# EAGLE design mini_controller_m328_2 (EAGLE 9.6.2)
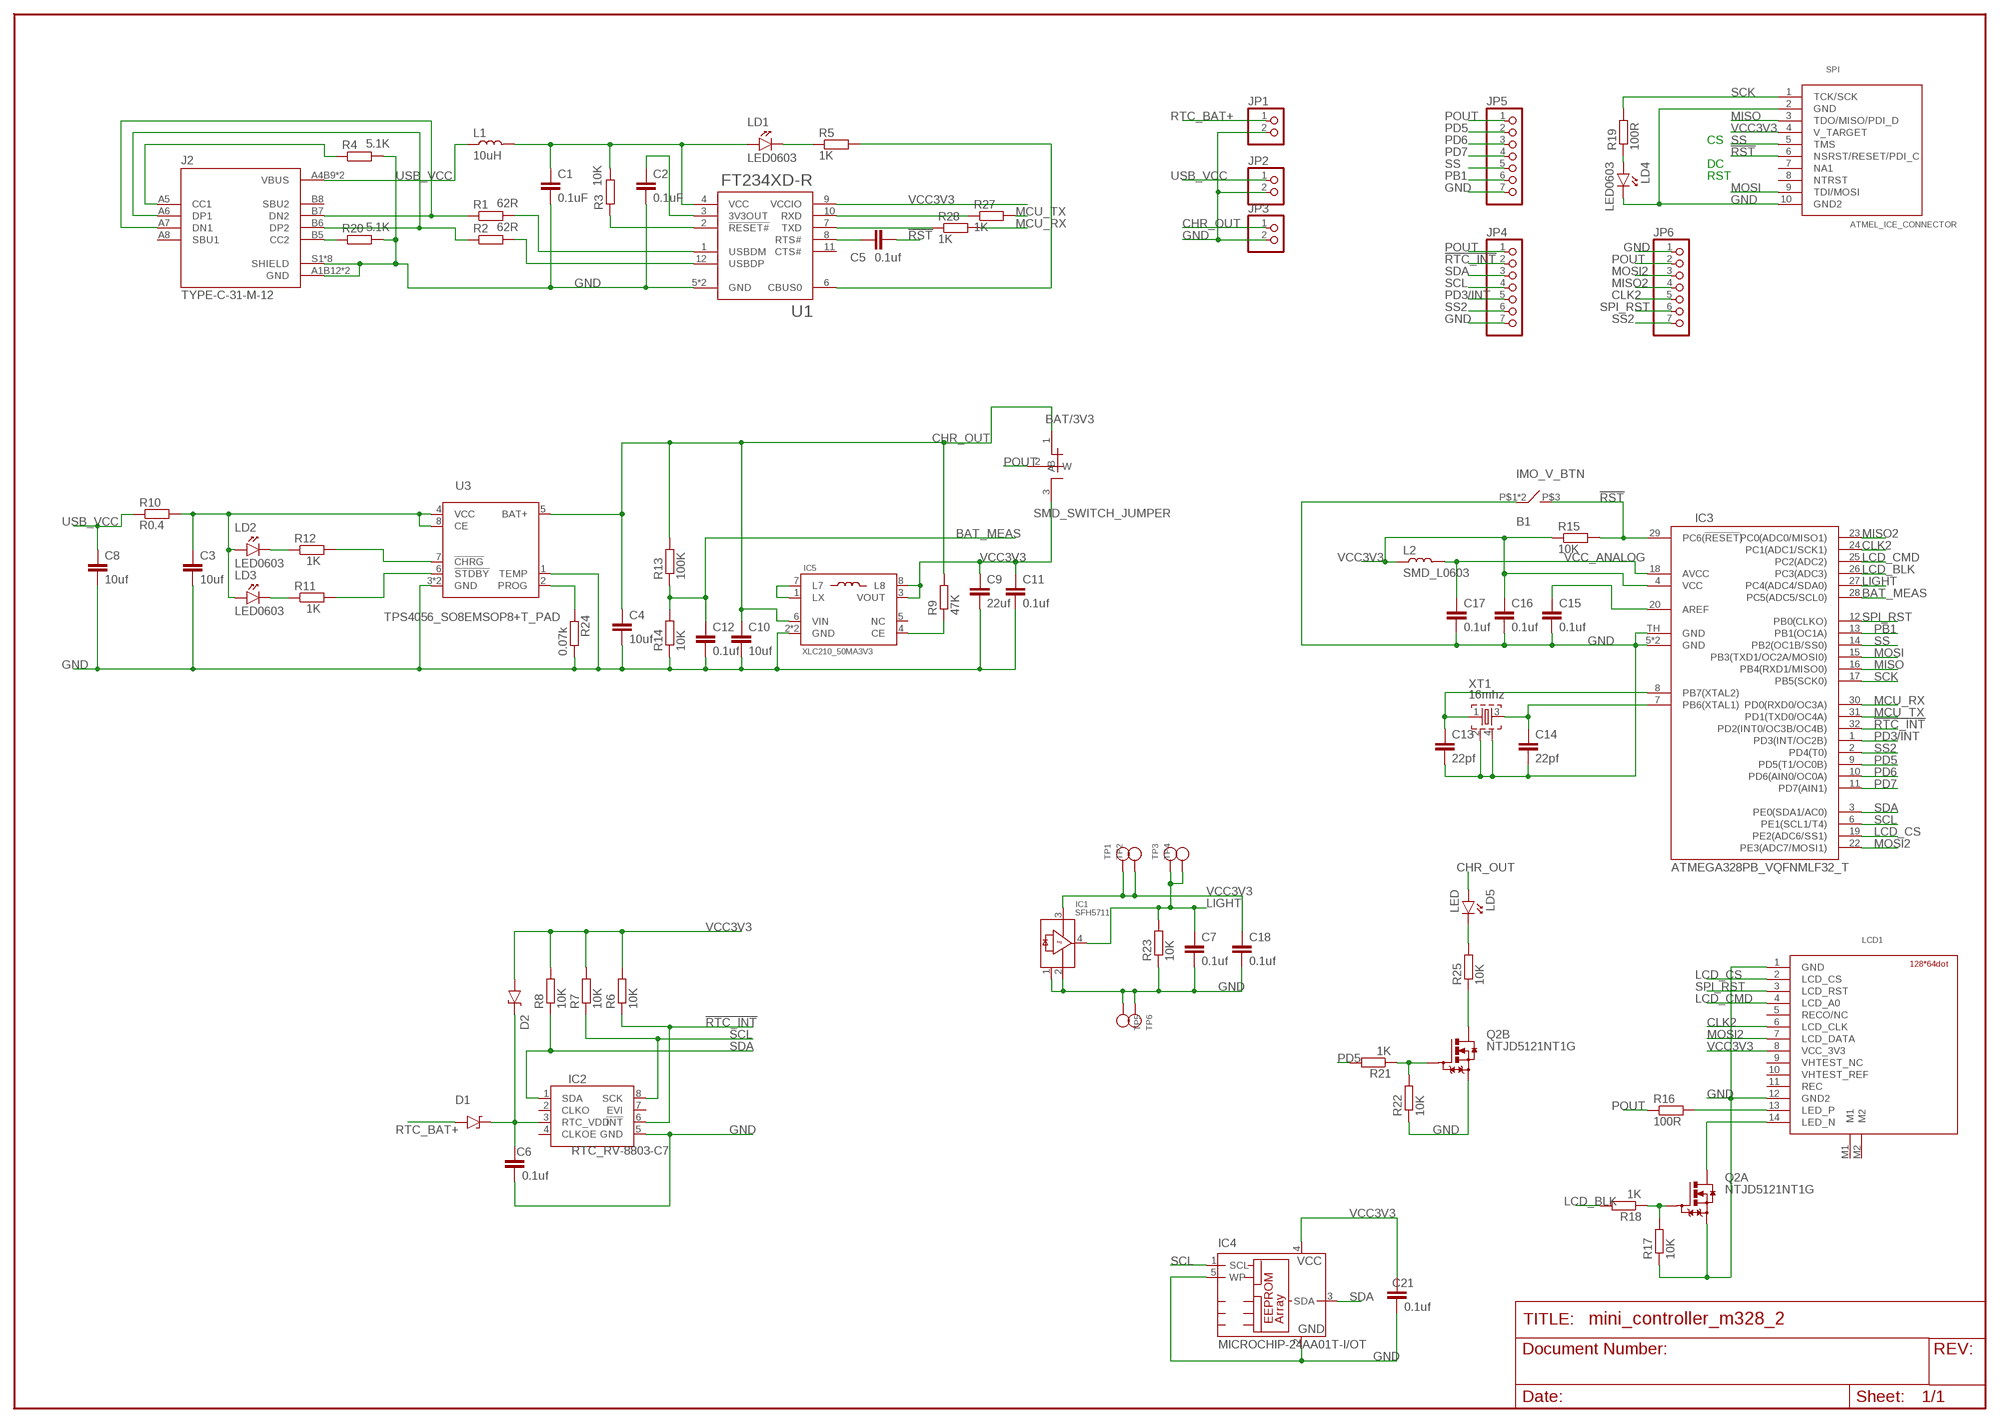
[diagram p0: schematic, sheet 1]

## Parts
B1  IMO_V_BTN  [IMO_V_BNN]
BAT/3V3  SMD_SWITCH_JUMPER  [0603_JUMP]
C1  0.1uF  SMD_C0603  [0603]
C2  0.1uF  SMD_C0603  [0603]
C3  10uf  SMD_C1206  [1206]
C4  10uf  SMD_C1206  [1206]
C5  0.1uf  SMD_C0603  [0603]
C6  0.1uf  SMD_C0603  [0603]
C7  0.1uf  SMD_C0603  [0603]
C8  10uf  SMD_C1206  [1206]
C9  22uf  SMD_C0805  [0805]
C10  10uf  SMD_C0603  [0603]
C11  0.1uf  SMD_C0603  [0603]
C12  0.1uf  SMD_C0603  [0603]
C13  22pf  SMD_C0603  [0603]
C14  22pf  SMD_C0603  [0603]
C15  0.1uf  SMD_C0603  [0603]
C16  0.1uf  SMD_C0603  [0603]
C17  0.1uf  SMD_C0603  [0603]
C18  0.1uf  SMD_C0603  [0603]
C21  0.1uf  SMD_C0603  [0603]
D1  D_SOD323  [SOD-323_D]
D2  D_SOD323  [SOD-323_D]
IC1  SFH5711  [SFH5711]
IC2  RTC_RV-8803-C7  [C7_RTC]
IC3  ATMEGA328PB_VQFNMLF32_T  [MLF32-TH]
IC4  MICROCHIP-24AA01T-I/OT  [SOT-23(5)]
IC5  XLC210_50MA3V3  [XCL210_50MA3V3]
J2  TYPE-C-31-M-12  [HRO_TYPE-C-31-M-12]
JP1  PINHD-1X2  [1X02]
JP2  PINHD-1X2  [1X02]
JP3  PINHD-1X2  [1X02]
JP4  PINHD-1X7  [1X07]
JP5  PINHD-1X7  [1X07]
JP6  PINHD-1X7  [1X07]
L1  10uH  SMD_L0603  [0603]
L2  SMD_L0603  [0603]
LCD1  ALE_LCD_128X64  [ALE_LCD_14PIN_CONNECTOR]
LD1  LED0603  [0603_P]
LD2  LED0603  [0603_P]
LD3  LED0603  [0603_P]
LD4  LED0603  [0603_P]
LD5  LED  [3MM_DIP_LED]
Q2  NTJD5121NT1G  [SOT363]
R1  62R  SMD_R0603  [0603]
R2  62R  SMD_R0603  [0603]
R3  10K  SMD_R0603  [0603]
R4  5.1K  SMD_R0603  [0603]
R5  1K  SMD_R0603  [0603]
R6  10K  SMD_R0603  [0603]
R7  10K  SMD_R0603  [0603]
R8  10K  SMD_R0603  [0603]
R9  47K  SMD_R0603  [0603]
R10  R0.4  SMD_R1206  [1206]
R11  1K  SMD_R0603  [0603]
R12  1K  SMD_R0603  [0603]
R13  100K  SMD_R0603  [0603]
R14  10K  SMD_R0603  [0603]
R15  10K  SMD_R0603  [0603]
R16  100R  SMD_R0603  [0603]
R17  10K  SMD_R0603  [0603]
R18  1K  SMD_R0603  [0603]
R19  100R  SMD_R0603  [0603]
R20  5.1K  SMD_R0603  [0603]
R21  1K  SMD_R0603  [0603]
R22  10K  SMD_R0603  [0603]
R23  10K  SMD_R0603  [0603]
R24  0.07k  SMD_R0603  [0603]
R25  10K  SMD_R0603  [0603]
R27  1K  SMD_R0603  [0603]
R28  1K  SMD_R0603  [0603]
SPI  ATMEL_ICE_CONNECTOR  [MINI10P_SPI/JTAG/PDI]
TP1  TEST_POINT_D2MM  [TP]
TP2  TEST_POINT_D2MM  [TP]
TP3  TEST_POINT_D2MM  [TP]
TP4  TEST_POINT_D2MM  [TP]
TP5  TEST_POINT_D2MM  [TP]
TP6  TEST_POINT_D2MM  [TP]
U1  FT234XD-R  [IC_FT234XD-R]
U3  TPS4056_SO8EMSOP8+T_PAD  [EMSOP8+TPAD]
XT1  16mhz  QUARTZ_ZQ  [QUARTZ_3X3MM]

## Nets
!RST: B1.P$3 C5.2 IC3.29(PC6(!RESET!)) R15.2 SPI.6(NSRST/RESET/PDI_C)
!RTC_INT: IC2.6(!INT) IC3.32(PD2(INT0/OC3B/OC4B)) JP4.2 R6.1
BAT_MEAS: C12.1 IC3.28(PC5(ADC5/SCL0)) R13.1 R14.2
CHR_OUT: BAT/3V3.1(A) C4.1 C10.1 IC5.6(VIN) JP3.1 LD5.A R9.2 R13.2 U3.5(BAT+)
CLK2: IC3.24(PC1(ADC1/SCK1)) JP6.5 LCD1.6(LCD_CLK)
DM2: R1.2 U1.1(USBDM)
DP2: R2.2 U1.12(USBDP)
GND: B1.P$1 B1.P$2 C1.2 C2.2 C3.2 C4.2 C6.2 C7.2 C8.2 C9.2 C10.2 C11.2 C12.2 C13.2 C14.2 C15.2 C16.2 C17.2 C18.2 C21.2 IC1.1 IC1.2 IC2.5(GND) IC3.5(GND) IC3.21(GND) IC3.TH(GND) IC4.2(GND) IC4.5(WP) IC5.2(GND) IC5.9(GND) J2.A1B12(GND) J2.B1A12(GND) J2.S1(SHIELD) J2.S2(SHIELD) J2.S3(SHIELD) J2.S4(SHIELD) J2.S5(SHIELD) J2.S6(SHIELD) J2.S7(SHIELD) J2.S8(SHIELD) JP1.2 JP2.2 JP3.2 JP4.7 JP5.7 JP6.1 LCD1.1(GND) LCD1.12(GND2) LD4.1(K) Q2.1(A:S) Q2.4(B:S) R4.2 R14.1 R17.1 R20.2 R22.1 R23.1 R24.2 SPI.2(GND) SPI.10(GND2) TP5.P$1 TP6.P$1 U1.5(GND) U1.13(GND) U3.1(TEMP) U3.3(GND) U3.TPAD(GND) XT1.2 XT1.4
LCD_BLK: IC3.26(PC3(ADC3)) R18.2
LCD_CMD: IC3.25(PC2(ADC2)) LCD1.4(LCD_A0)
LCD_CS: IC3.19(PE2(ADC6/SS1)) LCD1.2(LCD_CS)
LIGHT: C7.1 IC1.4 IC3.27(PC4(ADC4/SDA0)) R23.2 TP3.P$1 TP4.P$1
MCU_RX: IC3.30(PD0(RXD0/OC3A)) R28.2
MCU_TX: IC3.31(PD1(TXD0/OC4A)) R27.2
MISO: IC3.16(PB4(RXD1/MISO0)) SPI.3(TDO/MISO/PDI_D)
MISO2: IC3.23(PC0(ADC0/MISO1)) JP6.4
MOSI: IC3.15(PB3(TXD1/OC2A/MOSI0)) SPI.9(TDI/MOSI)
MOSI2: IC3.22(PE3(ADC7/MOSI1)) JP6.3 LCD1.7(LCD_DATA)
N$1: LCD1.13(LED_P) R16.2
N$2: LCD1.14(LED_N) Q2.6(A:D)
N$3: IC5.1(LX) IC5.7(L7)
N$4: Q2.2(A:G) R17.2 R18.1
N$5: IC5.4(CE) R9.1
N$6: C3.1 LD2.2(A) LD3.2(A) R10.2 U3.4(VCC) U3.8(CE)
N$7: C1.1 L1.2 LD1.2(A) R3.2 U1.4(VCC)
N$8: C13.1 IC3.8(PB7(XTAL2)) XT1.1
N$9: C2.1 U1.3(3V3OUT)
N$10: LD1.1(K) R5.1
N$11: R5.2 U1.6(CBUS0)
N$12: C14.1 IC3.7(PB6(XTAL1)) XT1.3
N$13: R24.1 U3.2(PROG)
N$14: R27.1 U1.10(RXD)
N$15: C5.1 U1.8(RTS#)
N$16: LD4.2(A) R19.1
N$17: J2.A5(CC1) R4.1
N$18: R12.2 U3.7(!CHRG)
N$19: C6.1 D1.K D2.K IC2.3(RTC_VDD)
N$20: C15.1 IC3.20(AREF)
N$21: J2.A7(DN1) J2.B7(DN2) R1.1
N$22: J2.A6(DP1) J2.B6(DP2) R2.1
N$23: LD2.1(K) R12.1
N$24: LD3.1(K) R11.1
N$25: R11.2 U3.6(!STDBY)
N$26: Q2.5(B:G) R21.1 R22.2
N$27: R28.1 U1.7(TXD)
N$28: J2.B5(CC2) R20.1
N$29: LD5.K R25.2
N$30: Q2.3(B:D) R25.1
PB1: IC3.13(PB1(OC1A)) JP5.6
PD3/INT: IC3.1(PD3(INT/OC2B)) JP4.5
PD5: IC3.9(PD5(T1/OC0B)) JP5.2 R21.2
PD6: IC3.10(PD6(AIN0/OC0A)) JP5.3
PD7: IC3.11(PD7(AIN1)) JP5.4
POUT: BAT/3V3.2(W) JP4.1 JP5.1 JP6.2 R16.1
RTC_BAT+: D1.A JP1.1
SCK: IC3.17(PB5(SCK0)) R19.2 SPI.1(TCK/SCK)
SCL: IC2.8(SCK) IC3.6(PE1(SCL1/T4)) IC4.1(SCL) JP4.4 R7.1
SDA: IC2.1(SDA) IC3.3(PE0(SDA1/AC0)) IC4.3(SDA) JP4.3 R8.1
SER_RST: R3.1 U1.2(!RESET#)
SPI_RST: IC3.12(PB0(CLKO)) JP6.6 LCD1.3(LCD_RST)
SS: IC3.14(PB2(OC1B/SS0)) JP5.5 SPI.5(TMS)
SS2: IC3.2(PD4(T0)) JP4.6 JP6.7
USB_VCC: C8.1 J2.A4B9(VBUS) J2.B4A9(VBUS) JP2.1 L1.1 R10.1
VCC3V3: BAT/3V3.3(B) C9.1 C11.1 C16.1 C18.1 C21.1 D2.A IC1.3 IC3.4(VCC) IC4.4(VCC) IC5.3(VOUT) IC5.8(L8) L2.1 LCD1.8(VCC_3V3) R6.2 R7.2 R8.2 R15.1 SPI.4(V_TARGET) TP1.P$1 TP2.P$1 U1.9(VCCIO)
VCC_ANALOG: C17.1 IC3.18(AVCC) L2.2
Unconnected: IC2.2(CLKO) IC2.4(CLKOE) IC2.7(EVI) IC5.5(NC) J2.A8(SBU1) J2.B8(SBU2) LCD1.5(RECO/NC) LCD1.9(VHTEST_NC) LCD1.10(VHTEST_REF) LCD1.11(REC) LCD1.M1 LCD1.M2 SPI.7(NA1) SPI.8(NTRST) U1.11(CTS#)

## Notes on the sheet
- CS
- DC
- RST

## Library data of the parts
B1 = passive_components:IMO_V_BTN
BAT/3V3 = passive_components:SMD_SWITCH_JUMPER
C1-C18 C21 = passive_components:SMD_C
D1 D2 = rcl:D_SOD323
IC1 = SFH5711:SFH5711; AVAILABILITY: Unavailable; DESCRIPTION: Optical Sensor Ambient 555nm Current 4-SMD, No Lead; MF: OSRAM Opto; MP: SFH5711; PACKAGE: SMD-4 OSRAM Opto; PRICE: None
IC2 = my_IC:RTC_RV-8803-C7
IC3 = my_IC:ATMEGA328PB_VQFN
IC4 = my_IC:MICROCHIP-24AA01T-I/OT
IC5 = my_IC:XLC210_50MA3V3
J2 = TYPE-C-31-M-12:TYPE-C-31-M-12: USB Connectors 24 Receptacle 1 8.94*7.3mm RoHS Check availability <https://pricing.snapeda.com/parts/TYPE-C-31-M-12/HRO%20Electronics%20Co.%2C%20Ltd./view-part?ref=eda>; AVAILABILITY: In Stock; DESCRIPTION: USB Connectors 24 Receptacle 1 8.94*7.3mm RoHS; MF: HRO Electronics Co., Ltd.; MP: TYPE-C-31-M-12; PACKAGE: Package; PRICE: None
JP1-JP3 = pinhead:PINHD-1X2: PIN HEADER
JP4-JP6 = pinhead:PINHD-1X7: PIN HEADER
L1 L2 = passive_components:SMD_L
LCD1 = passive_components:ALE_LCD_128X64
LD1-LD5 = passive_components:LED
Q2 = on-semiconductor-ntjd5121nt1g:NTJD5121NT1G: NTJD5121N, Dual N−Channel with ESD Power MOSFET 60 V, 295 mA, Dual N−Channel with ESD Protection, SC−88 Source: Datasheet <http://www.farnell.com/datasheets/1708304.pdf>; MF: ON SEMICONDUCTOR; MPN: NTJD5121NT1G; OC_FARNELL: 2317611; OC_NEWARK: unknown
R1-R25 R27 R28 = passive_components:SMD_R
SPI = passive_components:ATMEL_ICE_CONNECTOR
TP1-TP6 = passive_components:TEST_POINT_D2MM
U1 = my_IC:FT234XD-R: USB Bridge, USB to UART USB 2.0 UART Interface 12-DFN (3x3); AVAILABILITY: Unavailable; DESCRIPTION: USB Bridge, USB to UART USB 2.0 UART Interface 12-DFN (3x3); MF: FTDI,; MP: FT234XD-R; PACKAGE: DFN-12 FTDI; PRICE: None
U3 = my_IC:TPS4056_SO8
XT1 = passive_components:QUARTZ_ZQ

## Board
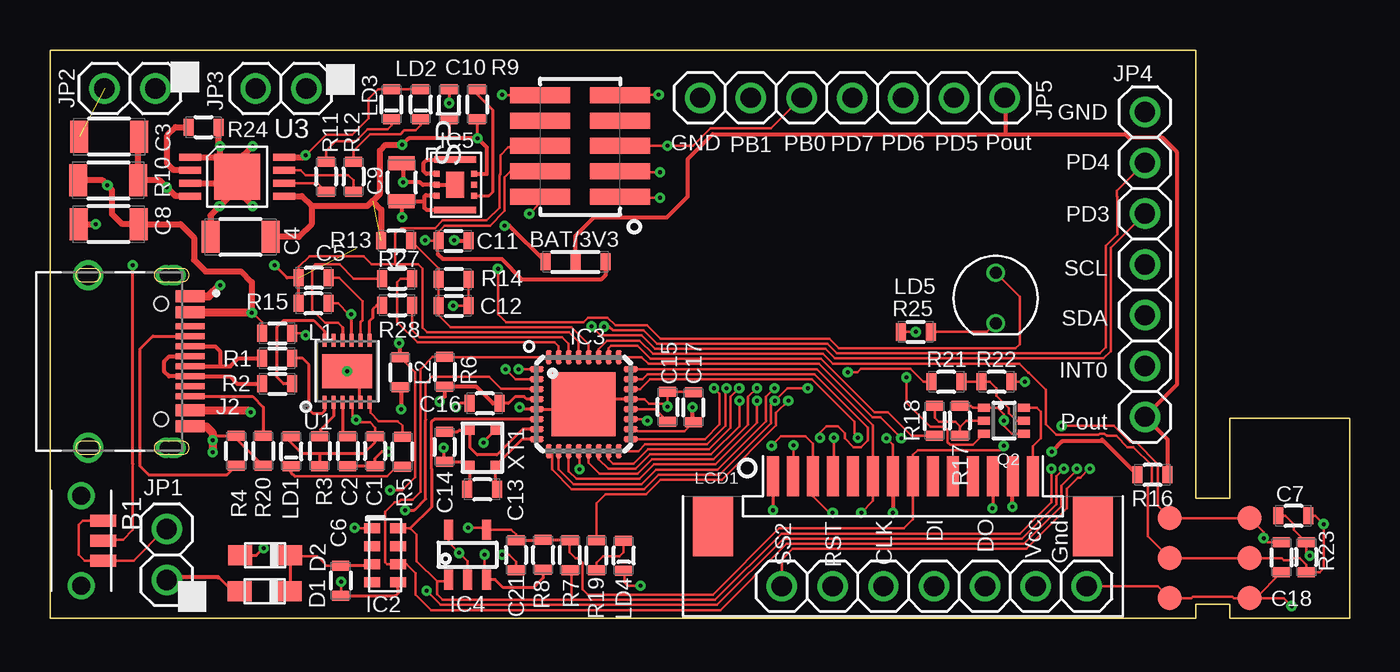
[diagram p1: board, top side]
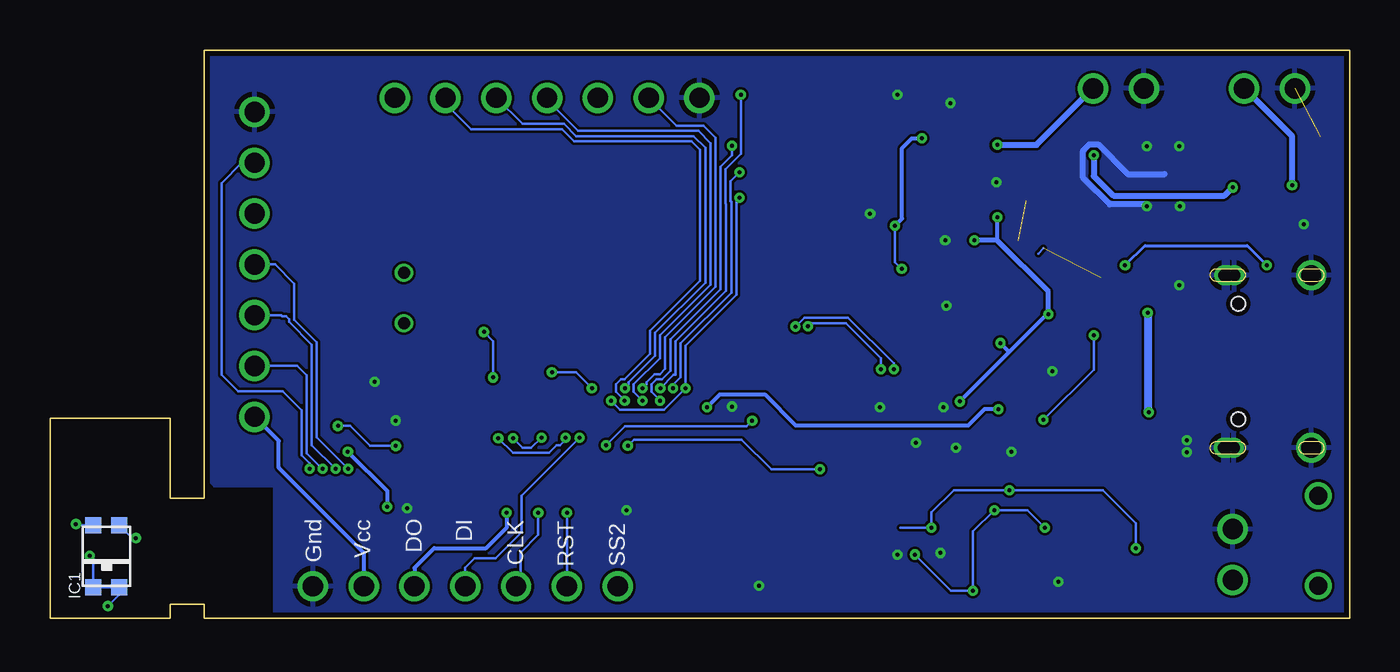
[diagram p2: board, bottom side, seen from below]

Size 65 x 28.4 mm. Coordinates in mm from the lower left corner, seen from the top.
Outline: 65,0 65,10 59,10 59,6 57.3,6 57.3,28.4 0,28.4 0,0 57.3,0 57.3,0.7 59,0.7 59,0 65,0
Copper layers (1*16): Top 0.035mm / dielectric 1.5mm / Bottom 0.035mm
Design rules "default *": minimum track width 5mil, minimum drill 0.2mm, track to track 5mil, track to pad 5mil, pad to pad 5mil, via to via 5mil, smd to smd 5mil, copper to edge 10mil, drill to drill 0.4mm, minimum pad ring 6mil, minimum via ring 6mil, stop-mask expansion 4mil, vias tented up to drill 20mil, thermal gap 10mil

### Footprints (pad centres in the part's own frame; a part is rotated, then mirrored left to right if it is on the bottom)
IMO_V_BNN = drill 0.9: M1 -2.25,0; M2 2.25,0 | smd 0.6 x 1.3: P$1 -1,-1.1; P$2 1,-1.1; P$3 0,-1.1
0603_JUMP = smd 0.85 x 0.5: 1 0,0.75; 2 0,-0.75; 3 0,-2.25
0603 = smd 0.85 x 0.5: 1 0,0.75; 2 0,-0.75
1206 = smd 1.6 x 0.9: 1 0,1.5; 2 0,-1.5
0805 = smd 1.3 x 0.7: 1 0,0.95; 2 0,-0.95
SOD-323_D = smd 1.2 x 1: A 1.25,0; K -1.25,0
SFH5711 = smd 0.8 x 0.8: 1 -0.65,-1.55; 2 0.65,-1.55; 3 0.65,1.55; 4 -0.65,1.55
C7_RTC = smd 0.8 x 0.5: 1 -0.65,1.35; 2 -0.65,0.45; 3 -0.65,-0.45; 4 -0.65,-1.35; 5 0.65,-1.35; 6 0.65,-0.45; 7 0.65,0.45; 8 0.65,1.35
MLF32-TH = smd 0.7 x 0.3: 1 -2.35,1.75; 2 -2.35,1.25; 3 -2.35,0.75; 4 -2.35,0.25; 5 -2.35,-0.25; 6 -2.35,-0.75; 7 -2.35,-1.25; 8 -2.35,-1.75; 17 2.35,-1.75; 18 2.35,-1.25; 19 2.35,-0.75; 20 2.35,-0.25; 21 2.35,0.25; 22 2.35,0.75; 23 2.35,1.25; 24 2.35,1.75 | smd 0.3 x 0.7: 9 -1.75,-2.35; 10 -1.25,-2.35; 11 -0.75,-2.35; 12 -0.25,-2.35; 13 0.25,-2.35; 14 0.75,-2.35; 15 1.25,-2.35; 16 1.75,-2.35; 25 1.75,2.35; 26 1.25,2.35; 27 0.75,2.35; 28 0.25,2.35; 29 -0.25,2.35; 30 -0.75,2.35; 31 -1.25,2.35; 32 -1.75,2.35 | smd 3.2 x 3.2: TH 0,0
SOT-23(5) = smd 0.45 x 1: 1 -0.95,-1.25; 2 0,-1.25; 3 0.95,-1.25; 4 0.95,1.25; 5 -0.95,1.25
XCL210_50MA3V3 = smd 0.3 x 0.3: 1 -0.92,0.55; 2 -0.92,0; 3 -0.92,-0.55; 4 0.95,-0.55; 5 0.95,0; 6 0.95,0.55 | smd 2.1 x 0.325: 7 0,1.262; 8 0,-1.262 | smd 0.9 x 1.3: 9 0,0
HRO_TYPE-C-31-M-12 = smd 0.6 x 1.45: A1B12 -3.25,5.095; A4B9 -2.45,5.095; B1A12 3.25,5.095; B4A9 2.45,5.095 | smd 0.3 x 1.45: A5 -1.25,5.095; A6 -0.25,5.095; A7 0.25,5.095; A8 1.25,5.095; B5 1.75,5.095; B6 0.75,5.095; B7 -0.75,5.095; B8 -1.75,5.095 | drill 0.6 pad 1: S1 -4.32,4.18; S2 4.32,4.18; S5 -4.31,3.87; S6 -4.31,4.37; S7 4.32,3.88; S8 4.32,4.38 | drill 1 pad 1.4: S3 -4.32,0; S4 4.32,0 | hole 0.7: -2.89,3.65; 2.89,3.65
1X02 = drill 1.016: 1 -1.27,0; 2 1.27,0
1X07 = drill 1.016: 1 -7.62,0; 2 -5.08,0; 3 -2.54,0; 4 0,0; 5 2.54,0; 6 5.08,0; 7 7.62,0
ALE_LCD_14PIN_CONNECTOR = smd 0.6 x 2: 1 6.5,-1; 2 5.5,-1; 3 4.5,-1; 4 3.5,-1; 5 2.5,-1; 6 1.5,-1; 7 0.5,-1; 8 -0.5,-1; 9 -1.5,-1; 10 -2.5,-1; 11 -3.5,-1; 12 -4.5,-1; 13 -5.5,-1; 14 -6.5,-1 | smd 2 x 3: M1 9.5,1.5; M2 -9.5,1.5
0603_P = smd 0.85 x 0.5: 1 0,0.75; 2 0,-0.75
3MM_DIP_LED = drill 0.6: A 1.27,0; K -1.27,0
SOT363 = smd 0.4 x 0.6: 1 -0.65,-1; 2 0,-1; 3 0.65,-1; 4 0.65,1; 5 0,1; 6 -0.65,1
MINI10P_SPI/JTAG/PDI = smd 0.8 x 3: 1 0,-4; 2 0,0; 3 1.27,-4; 4 1.27,0; 5 2.54,-4; 6 2.54,0; 7 3.81,-4; 8 3.81,0; 9 5.08,-4; 10 5.08,0
TP = smd 1.2 x 1.2: P$1 0,0
IC_FT234XD-R = smd 0.65 x 0.25: 1 -1.55,1.125; 2 -1.55,0.675; 3 -1.55,0.225; 4 -1.55,-0.225; 5 -1.55,-0.675; 6 -1.55,-1.125; 7 1.55,-1.125; 8 1.55,-0.675; 9 1.55,-0.225; 10 1.55,0.225; 11 1.55,0.675; 12 1.55,1.125 | smd 1.7 x 2.5: 13 0,0
EMSOP8+TPAD = smd 0.35 x 1.1: 1 -0.975,-2.35; 2 -0.325,-2.35; 3 0.325,-2.35; 4 0.975,-2.35; 5 0.975,2.35; 6 0.325,2.35; 7 -0.325,2.35; 8 -0.975,2.35 | smd 2.3 x 2.3: TPAD 0,0
QUARTZ_3X3MM = smd 0.5 x 0.5: 1 -0.65,0.9; 2 0.65,0.9; 3 0.65,-0.9; 4 -0.65,-0.9

### Placement (x,y rotation side)
B1  1.56,3.87 90 top
BAT/3V3  25.53,17.81 90 top
C1  16.26,8.34 0 top
C2  14.89,8.34 0 top
C3  2.95,24.07 270 top
C4  9.53,19.05 270 top
C5  13.2,17 270 top
C6  14.54,1.87 0 top
C7  62.19,5.1 270 top
C8  2.93,19.69 270 top
C9  17.59,21.78 180 top
C10  19.97,25.69 180 top
C11  20.18,18.86 90 top
C12  20.19,15.61 90 top
C13  21.62,6.43 270 top
C14  19.73,8.56 0 top
C15  30.89,10.55 180 top
C16  21.75,10.73 270 top
C17  32.18,10.53 180 top
C18  61.59,3.03 0 top
C21  23.31,3.15 0 top
D1  10.73,1.33 180 top
D2  10.77,3.14 180 top
IC1  62.18,3.09 0 bottom
IC2  16.77,3.14 0 top
IC3  26.69,10.7 0 top
IC4  20.88,3.17 0 top
IC5  20.26,21.65 0 top
J2  1.91,12.83 270 top
JP1  5.84,3.17 90 top
JP2  4,26.48 180 top
JP3  11.56,26.48 180 top
JP4  54.76,17.68 90 top
JP5  40.14,26.01 180 top
JP6  44.23,1.59 180 top
L1  11.37,14.23 90 top
L2  17.52,12.28 0 top
LCD1  42.67,6.09 180 top
LD1  12.06,8.33 180 top
LD2  18.54,25.69 180 top
LD3  17.08,25.69 180 top
LD4  28.69,3.12 180 top
LD5  47.3,16 90 top
Q2  47.72,9.87 270 top
R1  11.37,12.98 90 top
R2  11.37,11.71 90 top
R3  13.5,8.34 0 top
R4  9.3,8.35 180 top
R5  17.63,8.32 180 top
R6  19.75,12.3 0 top
R7  26,3.14 180 top
R8  24.67,3.16 180 top
R9  21.37,25.69 0 top
R10  2.92,21.88 90 top
R11  13.81,22.07 0 top
R12  15.18,22.07 0 top
R13  17.31,18.86 270 top
R14  20.19,16.95 270 top
R15  13.18,15.73 270 top
R16  55.14,7.15 270 top
R17  45.5,9.87 0 top
R18  44.24,9.86 0 top
R19  27.34,3.13 180 top
R20  10.67,8.35 0 top
R21  44.83,11.81 270 top
R22  47.34,11.81 270 top
R23  62.83,3.04 0 top
R24  7.68,24.54 90 top
R25  43.3,14.3 90 top
R27  17.37,16.97 90 top
R28  17.37,15.65 90 top
SPI  24.52,21.06 90 top
TP1  56,5 0 top
TP2  60,5 0 top
TP3  60,3 0 top
TP4  56,3 0 top
TP5  56,1 0 top
TP6  60,1 0 top
U1  14.86,12.34 90 top
U3  9.37,22.07 270 top
XT1  21.63,8.52 180 top

### Tracks (layer width: path | path; a pad name or v marks a point on that pad's centre or on a via)
!RST  (via drill 0.2)  (1 unrouted)
  Top 0.127: 17.27,17.68 18.41,17.68 18.64,17.46 18.64,14.51 18.86,14.29 25.97,14.29 26.44,13.81 IC3.29 | 17.27,17.68 16.1,17.68 15.68,18.1 12.99,18.1 12.45,17.56 C5.2 | SPI.6 24.44,23.53 22.92,23.53 22.54,23.15 22.54,22.2 22.48,22.14 22.48,20.51 21.84,19.88 19.64,19.88 19.26,19.49 17.56,19.49 17.27,19.21 17.27,17.68 | B1.P$3 2.69,3.9 3.65,3.9 4.15,4.4 4.15,7.69
  Top 0.152: 4.15,7.69 4.15,17.62 v4.13,17.63 | v11.23,17.63 11.85,17 C5.2 12.43,16.99 R15.2
  Bottom 0.127: 15.3,18.48 15.56,18.22
  Bottom 0.152: v4.13,17.63 5.12,18.62 10.24,18.62 v11.23,17.63
!RTC_INT  (via drill 0.2)
  Top 0.127: IC3.32 R6.1 19.15,13.05 18.53,12.43 18.53,6.3 18.13,5.91 17.55,5.91 17.42,5.78 17.24,5.78 16.76,5.3 16.76,2.79 16.87,2.69 IC2.6 17.84,2.69 18.29,2.23 18.29,1.17 19.06,0.4 33.53,0.4 36.85,3.71 48.72,3.71 50.6,5.59 50.6,6.62 51.35,7.38 v51.35,7.47
  Bottom 0.127: JP4.2 52.63,12.6 52.16,12.13 52.16,8.24 51.38,7.47 v51.35,7.47
BAT_MEAS
  Top 0.127: R13.1 19.45,17.48 R14.2 C12.1 19.45,15.13 20.03,14.54 26.08,14.54 26.94,13.68 IC3.28
CHR_OUT  (via drill 0.2)  (1 unrouted)
  Top 0.127: v22.4,17.46 22.4,15.2 22.8,14.8 26.68,14.8 26.91,15.02 27.9,15.02 28.28,14.64 29.86,14.64 30.53,13.97 38.99,13.97 39.47,13.49 48.29,13.49 48.5,13.7 48.5,16.07 LD5.A
  Top 0.152: C10.1 19.97,23.98 | R9.2 21.37,24.05 21.3,23.98
  Top 0.2: IC5.6 21.84,22.2 21.84,23.54 v21.4,23.98 21.3,23.98 19.97,23.98 17.95,23.98 v17.62,23.65
  Top 0.203: BAT/3V3.1 22.97,19.62 v22.73,19.62
  Top 0.305: R13.2 16.56,20.42 16.13,20.85 15.88,20.61 13.08,20.61 | 16.16,20.85 16.51,21.2 16.51,23.37 16.8,23.65 v17.62,23.65 | U3.5 12.6,21.09 13.08,20.61 | 13.08,20.61 13.08,19.68 12.45,19.05 C4.1
  Bottom 0.127: v22.73,19.62 22.73,17.79 v22.4,17.46
  Bottom 0.203: v22.73,19.62 22.38,19.97 22.38,23.5 21.9,23.98 v21.4,23.98
  Bottom 0.305: v17.62,23.65 15.65,23.65 JP3.1
CLK2  (via drill 0.2)
  Top 0.127: IC3.24 38.35,12.45 41.17,9.63 LCD1.6 41.17,5.86 v40.58,5.27
  Bottom 0.127: v40.58,5.27 40.58,4.16 41.47,3.27 41.47,1.81 JP6.5
DM2
  Top 0.152: U1.1 13.74,10.37 13.59,10.22 13.17,10.22 12.96,10.44 12.96,12.66 12.64,12.98 R1.2
DP2
  Top 0.152: R2.2 11.69,11.71 11.37,12.03 11.37,14.56 11.69,14.88 13.18,14.88 13.74,14.32 U1.12
GND  (via drill 0.2)  (1 unrouted)
  Top 0.127: LCD1.12 47.11,7.15 | v14.56,1.81 14.56,1.13 C6.2 | IC4.2 20.88,2.85 v20.47,3.25 19.93,3.79 IC4.5 | C21.2 23.31,2.82 22.96,3.17 v22.61,3.17 | U1.13 v14.87,12.33 | R14.1 C12.2 v20.17,15.61 v20.16,15.62 | IC3.21 29.73,10.95 29.97,10.7 30.77,10.7 v30.89,10.57 C15.2 32.16,11.3 C17.2 | SPI.10 22.62,26.14 v22.61,26.16 | SPI.2 24.52,20.77 v23.98,20.22 | Q2.4 48.12,9.22 47.72,9.62 v47.72,9.87 47.72,10.19 47.39,10.52 Q2.1 46.7,10.51 46.16,10.51 46.05,10.62 R17.1 | R22.1 v48.77,11.81 | B1.P$2 1.64,4.87 1.43,4.67 1.43,3.17 1.73,2.87 B1.P$1 4.17,2.87 5.75,4.45 JP1.2 | LD4.1 28.73,2.33 28.73,1.78 28.89,1.62 v29.53,1.62 | JP6.1 55.41,1.59 TP5.P$1 57.1,1 57.15,1.06 59.15,1.06 59.2,1 TP6.P$1 | C18.2 60.31,1 TP6.P$1 | TP6.P$1 61.7,1 v62.1,0.6 | v63.01,3.11 62.83,3.29 R23.1 62.2,4.42 62.2,4.7 61.8,5.1 C7.2
  Top 0.152: U1.5 15.5,10.83 15.5,11.71 v14.87,12.33 | C2.2 C1.2 16.26,7.98 16.59,8.32 v16.92,8.32 | C6.2 17.29,1.11 17.42,1.25 IC2.5 | LCD1.1 v36.17,5.39 v36.17,5.38 | LCD1.12 47.17,5.51 v47.14,5.49 | C10.2 v19.97,25.75 | v8.13,8.89 8.34,9.1 R4.2 9.3,8.97 R20.2 | C13.2 20.98,6.54 XT1.2 20.79,7.8 C14.2 19.68,7.85 v19.68,8.51 | v21.68,8.76 21.68,8.82 XT1.4 | C16.2 20.51,10.73 v20.32,10.54 | v23.5,10.54 23.59,10.45 IC3.5 25.34,10.45 25.37,10.41 26.41,10.41 IC3.TH 26.94,10.95 IC3.21
  Top 0.2: IC5.9 IC5.2 18.64,21.65 18.51,21.78 v17.65,21.78 17.65,22.67 C9.2
  Top 0.203: C11.2 20.25,18.86 v20.23,18.89 20.23,18.87
  Top 0.305: C8.2 v2.28,19.69 v2.29,19.68 | U3.3 9.04,21.74 U3.TPAD | U3.1 8.39,23.04 U3.TPAD | U3.TPAD 9.37,21.47 v8.48,20.58 8.03,20.13 C4.2 | U3.TPAD 9.37,21.34 v10.13,20.58 | U3.TPAD 8.51,22.92 v8.51,23.59 8.43,23.67 R24.2 | U3.TPAD 9.37,22.83 v10.13,23.59
  Top 0.406: J2.A1B12 7.95,16.08 v8.51,16.64 | J2.B1A12 7.82,9.58 8.13,9.27 v8.13,8.89 v8.13,8.29
  Bottom 0.127: v62.1,0.6 61.53,1.17 IC1.2 IC1.1 62.83,2.93 v63.01,3.11
  Bottom 0.305: v10.13,20.58 10.23,20.68 11.99,20.68 13.33,22.02 13.33,23.37 13.02,23.68 12.57,23.68 11.09,22.19 9.24,22.19
  Bottom 0.356: JP5.7
  pour Bottom: 0.14,28.22 0.14,0.1 53.77,0.1 53.77,28.22
  pour Bottom: 51.55,28.22 57.06,28.22 57.21,28.07 57.21,7 56.8,6.59 51.55,6.59
LCD_BLK
  Top 0.127: IC3.26 27.94,13.5 28.07,13.62 29.38,13.62 30.05,12.96 38.56,12.96 41.23,10.29 41.9,10.29 43.08,9.11 R18.2
LCD_CMD  (via drill 0.2)
  Top 0.127: IC3.25 29.59,13.05 29.94,12.7 38.46,12.7 41.13,10.03 41.53,10.03 v42.58,8.98 | v39.21,9.02 39.21,7.13 LCD1.4
  Bottom 0.127: v42.58,8.98 41.85,8.26 40.05,8.26 39.66,8.64 39.5,8.64 39.21,8.92 v39.21,9.02
LCD_CS  (via drill 0.2)
  Top 0.127: 37.19,7.86 37.19,7.11 LCD1.2 37.18,7.1 v37.18,8.64 | IC3.19 29.8,9.95 v29.88,9.87
  Bottom 0.127: v29.88,9.87 30.16,9.59 36.23,9.59 v37.18,8.64
LIGHT  (via drill 0.2)
  Top 0.127: IC3.27 27.44,13.44 27.88,13.88 29.48,13.88 30.15,13.21 38.67,13.21 39.16,12.72 48.48,12.72 48.95,12.25 49.8,11.4 49.8,10.44 49.82,10.42 49.82,9.68 50.34,9.16 52.45,9.16 52.5,9.21 52.74,9.21 52.86,9.1 53.34,9.1 53.9,8.55 54.2,8.55 55.1,7.64 55.1,6.8 54.9,6.6 54.9,4.1 TP4.P$1 TP3.P$1 61.6,3 61.7,2.9 62,2.9 62.1,3 62.5,3 62.83,2.67 R23.2 | R23.2 | C7.1 63.3,5.1 v63.7,4.7 63.7,2.5 63.5,2.3 R23.2
  Bottom 0.127: v63.7,4.7 63.64,4.64 IC1.4
MCU_RX
  Top 0.127: R28.2 18.12,14.4 18.49,14.03 25.62,14.03 25.94,13.71 IC3.30
MCU_TX
  Top 0.127: R27.2 17.54,16.97 17.37,16.8 17.37,14.8 18.38,13.78 25.24,13.78 25.44,13.58 IC3.31
MISO  (via drill 0.2)
  Top 0.127: IC3.16 29.43,8.35 29.77,8.69 32.86,8.69 33.78,9.61 33.78,11.44 v33.84,11.49 | v30.51,22.29 28.57,22.29 SPI.3
  Bottom 0.127: v33.84,11.49 33.84,11.65 33.47,12.03 33.47,13.73 30.92,16.27 30.92,20.8 30.95,20.84 30.95,21.85 v30.51,22.29
MISO2  (via drill 0.2)
  Top 0.127: IC3.23 29.63,11.95 29.88,12.19 38.25,12.19 40.92,9.52 40.92,8.89 40.57,8.54 40.2,8.54 39.75,8.98 39.75,9.24 39.4,9.59 38.83,9.59 38.51,9.27 v38.51,9.02
  Bottom 0.127: v38.51,9.02 41.41,6.12 41.41,4.28 42.7,2.98 43.75,2.98 44.23,2.51 JP6.4
MOSI  (via drill 0.2)
  Top 0.127: IC3.15 27.94,7.93 28.16,7.71 29.18,7.71 29.9,8.44 32.97,8.44 34.04,9.51 34.04,11.06 v34.47,11.49 | v30.45,26.16 28.54,26.16 SPI.9
  Bottom 0.127: v34.47,11.49 33.81,12.16 33.72,12.16 33.72,13.83 31.18,16.37 31.18,20.7 31.21,20.73 31.21,22.45 30.45,23.21 v30.45,26.16
MOSI2  (via drill 0.2)
  Top 0.127: IC3.22 29.51,11.45 30,11.94 38.1,11.94 40.23,9.81 40.23,9.24 40.42,9.05 v40.42,9.02 | v41.85,8.98 42.17,8.66 LCD1.7
  Top 0.2: LCD1.7 v42.17,5.28 v42.16,5.27
  Bottom 0.127: v40.42,9.02 40.93,8.51 41.37,8.51 v41.85,8.98
  Bottom 0.2: v42.16,5.27 42.16,4.51 43.18,3.49 45.78,3.49 46.77,2.51 JP6.3
N$1  (via drill 0.2)
  Top 0.203: R16.2 52.71,8.83 | 52.71,8.83 52.62,8.92 | 52.71,8.83 50.62,8.83 v50.1,8.32 | v48.13,5.56 48.13,7.05 48.16,7.08
  Top 0.305: 48.16,7.08 LCD1.13
  Bottom 0.203: v50.1,8.32 48.13,6.35 v48.13,5.56
N$2
  Top 0.127: LCD1.14 49.17,8.29 49.17,8.36 49.17,8.6 49.56,8.98 49.56,10.32 49.36,10.52 Q2.6
  Top 0.152: LCD1.14
N$3
  Top 0.2: IC5.1 18.82,22.2 18.67,22.35 18.67,22.73 18.85,22.92 IC5.7
N$4
  Top 0.127: R17.2 45.5,9.53 45.53,9.56 | Q2.2 45.85,9.87 45.53,9.56 | R18.1 44.26,10.59 44.26,10 44.45,9.81 45.28,9.81 45.53,9.56
N$5
  Top 0.152: IC5.4 21.96,21.1 22.16,21.3 22.16,25.4 21.37,26.19 R9.1
N$6  (via drill 0.2)
  Top 0.127: LD2.2 LD3.2 16.4,26.44 15.94,25.97 15.94,24.99 15.11,24.16 13.81,24.16 v12.79,23.15
  Top 0.305: 4.61,24.23 C3.1 4.42,24.04 R10.2 5.49,21.88 v5.84,21.53 6.28,21.09 U3.4 | U3.8 12.69,23.04 v12.79,23.15
  Bottom 0.305: v12.79,23.15 12.79,22.1 11.81,21.11 6.25,21.11 v5.84,21.53
N$7  (via drill 0.2)
  Top 0.127: U1.4 15.14,10.73 15.14,10.06 v15.3,9.91 15.43,9.78 16,9.78 16.26,9.52 C1.1 | L1.2 12.7,14.23 v12.79,14.13
  Top 0.152: LD1.2 11.9,8.92 12.6,8.23 13.47,8.23 | C1.1 16.26,8.8 15.69,8.23 13.47,8.23 | 13.47,8.23 13.5,8.21 R3.2
  Bottom 0.127: v12.79,14.13 12.79,12.41 v15.3,9.91
N$8
  Top 0.152: C13.1 22.28,6.52 XT1.1 23.61,8.95 IC3.8
N$9
  Top 0.152: U1.3 14.64,9.35 C2.1
N$10
  Top 0.127: R5.1 17.34,7.57 16.86,7.08 12.25,7.08
  Top 0.152: 12.25,7.08 12.06,7.27 LD1.1
N$11
  Top 0.127: U1.6 16.03,10.75 16.03,10.26 16.45,9.84 17.4,9.84 17.63,9.61 R5.2
  Top 0.152: U1.6 16.01,10.77
N$12
  Top 0.152: IC3.7 23.64,9.45 22.35,8.16 21.37,8.16 21.02,8.51 21.02,9.37 20.98,9.4 | 20.98,9.4 XT1.3 | C14.1 20.39,9.3 20.48,9.4 20.98,9.4
N$13
  Top 0.305: U3.2 6.18,22.39 5.87,22.7 5.87,24.13 6.29,24.54 R24.1
N$14
  Top 0.127: R27.1 15.2,16.97 14.48,17.68 13.27,17.68 13.11,17.53 13.11,15.42 13.77,14.76 14.4,14.76 14.64,14.53
  Top 0.152: 14.64,14.53 U1.10
N$15
  Top 0.127: C5.1 14.46,17 15.62,15.83 15.62,14.89 15.54,14.81 U1.8
N$16
  Top 0.127: 27.31,2.36 R19.1 27.34,2.76 27.65,3.08 28.48,3.08 28.69,3.29 LD4.2
N$17
  Top 0.152: R4.1 8.85,7.14 4.95,7.14 4.51,7.59 4.51,13.46 5.14,14.1 6.98,14.1 J2.A5
N$18
  Top 0.127: U3.7 12.53,22.39 12.79,22.13 14.92,22.13 15.18,21.88 R12.2
N$19
  Top 0.127: C6.1 13.83,2.62 13.37,3.08 12.11,3.08 12.02,2.98
  Top 0.152: D2.K 12.02,2.98 12.02,1.36 D1.K | IC2.3 16.05,2.62 C6.1
N$20
  Top 0.127: IC3.20 30.29,10.45 30.89,9.84 C15.1
N$21
  Top 0.203: J2.A7 8.51,12.58 | 8.51,12.58 9.02,12.58 9.42,12.98 R1.1 | J2.B7 8.27,13.58 8.51,13.34 8.51,12.58
N$22
  Top 0.203: R2.1 9.37,11.71 9.01,12.08 J2.B6 5.96,12.08 5.71,12.32 5.71,12.83 5.97,13.08 J2.A6
N$23
  Top 0.127: R12.1 15.18,23.37 16,24.19 17.53,24.19 17.72,24.38 18.29,24.38 18.54,24.64 LD2.1
N$24
  Top 0.127: LD3.1 17.08,24.64 16.89,24.45 15.9,24.45 15.29,23.84 14.29,23.84 13.81,23.37 R11.1
N$25
  Top 0.127: U3.6 13.39,21.74 R11.2
N$26
  Top 0.127: Q2.5 48.35,9.87 47.97,10.25 47.97,10.48 47.34,11.11 47.34,11.49 47.02,11.81 R22.2 R21.1
N$27
  Top 0.152: U1.7 15.99,14.86 16.14,15.01 16.14,15.43 16.36,15.65 R28.1
N$28
  Top 0.152: J2.B5 10.13,11.08 10.67,10.54 R20.1
N$29
  Top 0.127: LD5.K 46.87,14.3 R25.2
N$30  (via drill 0.2)
  Top 0.127: Q2.3 46.15,8.65 45.03,8.65 44.89,8.79 44.89,9.41 44.74,9.56 44.04,9.56 42.85,10.75 v42.85,12.03 | v43.3,14.3 R25.1
  Bottom 0.127: v42.85,12.03 42.85,13.85 v43.3,14.3
PB1  (via drill 0.2)
  Top 0.127: IC3.13 26.94,7.76 27.5,7.21 29.39,7.21 30.11,7.93 33.18,7.93 34.92,9.67 34.92,11.06 v35.36,11.49
  Bottom 0.127: v35.36,11.49 35.17,11.68 35.17,11.78 34.76,12.19 34.5,12.19 34.23,12.46 34.23,14.04 31.72,16.55 31.72,24 32.32,24.61 33.65,24.61 JP5.6
PD3/INT  (via drill 0.2)
  Top 0.127: IC3.1 v23.43,12.45 | JP4.5 53.05,18.51 53.05,13.34 52.7,12.98 39.26,12.98 38.78,13.46 30.25,13.46 29.59,14.13 27.54,14.13 v27.09,14.58
  Bottom 0.127: v23.43,12.45 23.43,12.99 25.18,14.74 26.93,14.74 v27.09,14.58
PD5  (via drill 0.2)
  Top 0.127: IC3.9 25.1,8.19 25.1,7.43 26.09,6.45 29.7,6.45 30.43,7.17 33.5,7.17 36.06,9.74 36.06,10.67 v36.25,10.86 36.89,11.49 v37.9,11.49 | v39.9,12.28 40.38,12.28 40.57,12.47 43.03,12.47 43.69,11.81 R21.2
  Bottom 0.127: 45.16,25.95 JP5.2 45.22,25.72 43.94,24.45 39.39,24.45 38.79,23.84 32.91,23.84 32.48,23.41 32.48,16.87 34.99,14.36 34.99,13.21 36.26,11.94 36.43,11.94 36.69,11.68 36.69,11.31 36.25,10.88 v36.25,10.86 | v37.9,11.49 38.69,12.28 v39.9,12.28
PD6  (via drill 0.2)
  Top 0.127: IC3.10 25.44,7.45 26.19,6.7 29.6,6.7 30.32,7.42 33.39,7.42 35.81,9.84 35.81,11.06 v36.25,11.49
  Bottom 0.127: JP5.3 41.37,24.7 39.28,24.7 38.68,24.1 32.81,24.1 32.23,23.52 32.23,16.76 34.73,14.25 34.73,13.1 36.06,11.78 36.06,11.68 v36.25,11.49
PD7  (via drill 0.2)
  Top 0.127: IC3.11 25.94,7.34 26.33,6.95 29.49,6.95 30.22,7.68 33.28,7.68 35.37,9.76 v35.37,10.86
  Bottom 0.127: JP5.4 40.13,25.91 38.58,24.35 32.57,24.35 31.97,23.75 31.97,16.66 34.48,14.15 34.48,13 35.8,11.68 35.8,11.31 35.37,10.87 v35.37,10.86
POUT
  Top 0.203: BAT/3V3.2 26.28,19.1 27.21,20.03 30.86,20.03 31.91,21.08 31.91,22.95 33.15,24.19 47.82,24.19 | 47.82,24.19 53.78,24.19 53.94,24.04 55.63,24.04 56.36,23.3 56.36,11.65 JP4.1 55.89,8.93 R16.1 | 47.82,24.19 47.82,25.95 JP5.1
  Bottom 0.203: JP6.2 49.31,3.27 53.55,7.52 53.55,8.85 JP4.1
RTC_BAT+
  Top 0.152: D1.A 9.14,1.33 8.43,2.03
  Top 0.203: 8.43,2.03 5.97,2.03 JP1.1
SCK  (via drill 0.2)
  Top 0.127: IC3.17 32.76,8.95 33.5,9.68 33.5,11.21 v33.21,11.49 | v30.51,21.02 28.57,21.02 SPI.1 | v36.92,10.86 36.32,10.25 36.32,9.63 33.6,6.92 30.54,6.92 29.81,6.19 27.78,6.19 27.34,5.75 R19.2
  Bottom 0.127: v30.51,21.02 30.67,20.86 30.67,16.16 33.21,13.62 v33.21,11.49 34.29,10.42 36.48,10.42 v36.92,10.86
SCL  (via drill 0.2)
  Top 0.127: 19.35,1.83 19.35,1.2 19.64,0.91 26.1,0.91 | IC2.8 18.02,4.49 18.34,4.17 18.34,2.85 19.35,1.83 | 19.35,1.83 19.84,1.83 IC4.1 | 26.1,0.91 26.1,2.3 R7.1 | v50.09,7.47 50.09,5.8 48.51,4.22 36.58,4.22 33.26,0.91 26.1,0.91
  Top 0.152: IC3.6 19.22,9.95 19.07,9.8 19.07,7.46 19.08,7.45 19.08,5.55 18.02,4.49
  Bottom 0.127: JP4.4 53.75,17.68 52.78,16.71 52.78,14.91 51.65,13.78 51.65,9.03 v50.09,7.47
SDA  (via drill 0.2)
  Top 0.127: v18.83,1.36 19.54,0.65 33.36,0.65 36.68,3.97 48.62,3.97 50.34,5.69 50.34,7.08 v50.72,7.46 | 16.1,4.47 IC2.1 15.26,4.49 v15.24,4.51 | IC4.3 21.74,2.01 v21.74,3.17 21.77,3.21 | 18.79,9.92 18.79,11.74 19.11,12.06 21.97,12.06 22.57,11.46 24.33,11.46 IC3.3
  Top 0.15: R8.1 24.67,2 24.19,1.52 22.67,1.52 22.27,1.93 IC4.3
  Top 0.152: v17.77,5.39 18.23,5.39 18.79,5.95 18.79,9.92 | 24.33,11.43 IC3.3
  Bottom 0.127: JP4.3 53.45,15.14 53.39,15.09 53.19,15.09 53.03,14.94 53.03,14.8 51.91,13.67 51.91,8.65 v50.72,7.46 | v21.74,3.17 19.93,1.36 v18.83,1.36 18.83,4.33 v17.77,5.39 16.12,5.39 v15.24,4.51
SER_RST
  Top 0.152: U1.2 14.19,10.08 13.53,9.42 13.53,9.12 R3.1
SPI_RST  (via drill 0.2)
  Top 0.127: v36.1,8.6 36.57,9.08 37.78,9.08 38.15,8.71 38.15,7.11 LCD1.3 38.17,6.09 39.07,5.19 v39.15,5.27 | IC3.12 26.48,8.31 v26.48,7.43
  Bottom 0.127: v26.48,7.43 28.92,7.43 30.42,8.92 35.78,8.92 v36.1,8.6 | v39.15,5.27 JP6.6
SS  (via drill 0.2)
  Top 0.127: IC3.14 27.45,7.95 27.93,7.46 29.28,7.46 30.01,8.19 33.08,8.19 34.48,9.59 v34.48,10.86 | SPI.5 28.54,23.62 v30.89,23.62 32.16,23.62 33.03,24.49 36.07,24.49 JP5.5
  Bottom 0.127: v34.48,10.86 34.48,10.88 34.92,11.31 34.92,11.68 34.66,11.94 34.39,11.94 33.97,12.36 33.97,13.94 31.46,16.45 31.46,22.55 30.89,23.13 v30.89,23.62
SS2  (via drill 0.2)
  Top 0.127: v22.8,12.45 23.3,11.95 IC3.2 | JP4.6 53.37,21.37 53.37,21.08 53.38,21.07 53.38,19.2 52.8,18.62 52.8,13.53 52.5,13.23 39.37,13.23 38.88,13.72 30.36,13.72 29.69,14.38 28.16,14.38 27.97,14.57 v27.72,14.57 | JP6.7 36.61,2.92 37.15,3.46 48.83,3.46 50.85,5.48 50.85,6.46 51.41,7.02 51.54,7.02 51.97,7.46 v52.01,7.46
  Bottom 0.127: v27.72,14.57 27.27,15.02 25.09,15.02 22.8,12.73 v22.8,12.45 | v52.01,7.46 52.01,7.73 52.41,8.14 52.41,10.38 53.37,11.34 55.59,11.34 56.42,12.16 56.42,21.75 55.41,22.76 JP4.6
USB_VCC  (via drill 0.2)
  Top 0.127: v10.1,15.26 10.14,15.26 10.62,14.78 L1.1
  Top 0.305: R10.1 2.63,21.88 v2.87,21.64 3.11,21.4 3.11,20.19 3.62,19.69 C8.1 6.54,19.69 7.21,19.02 7.21,17.91 7.78,17.34 9.56,17.34 10.1,16.79 v10.1,15.26
  Top 0.406: J2.A4B9 10.09,15.28 v10.1,15.26 | v10.03,10.29 9.97,10.35 7.03,10.35 J2.B4A9
  Bottom 0.305: v2.87,21.64 2.87,24.08 JP2.1
  Bottom 0.406: v10.1,15.26 10.1,10.35 v10.03,10.29
VCC3V3  (via drill 0.2)
  Top 0.127: IC4.4 21.87,4.42 | 21.87,4.42 23.07,4.42 23.31,4.18 C21.1 | v20.9,4.52 21.77,4.52 21.87,4.42 | L2.1 18.27,12.28 18.27,7.05 17.62,6.39 v17.02,6.39 | SPI.4 23.03,22.34 22.73,22.04 22.73,20.35 22,19.62 19.75,19.62 19.43,19.3 C11.1 | R15.1 14.41,15.73 14.95,15.19 v15.07,15.19 | 25.98,3.87 25.98,3.3 26.29,2.98 26.42,2.98 26.64,2.76 26.64,1.43 26.91,1.16 33.15,1.16 36.47,4.48 42.7,4.48 43.17,4.94 LCD1.8 43.17,8.17 43.4,8.4 47.5,8.4 v47.7,8.6 | C11.1 18.79,18.86 v18.76,18.89 | 19.4,18.19 19.4,18.83 C11.1 | v50.6,9.6 53.2,9.6 54,8.8 54.3,8.8 55.4,7.7 55.4,5.6 TP1.P$1 TP2.P$1 60.7,4.3 v60.7,4 60.92,3.78 C18.1
  Top 0.15: R7.2 25.98,3.87 25.95,3.84 25.87,3.91 R8.2 C21.1
  Top 0.152: U1.9 15.09,15.19 v15.07,15.19 | D2.A 10.32,3.13 v10.68,3.5 | IC3.4 23.84,10.95 23.71,11.07 23.27,11.07 22.93,10.73 C16.1
  Top 0.2: IC5.8 18.85,20.39 18.73,20.51 18.73,20.83 | 18.73,20.83 18.73,21.08 18.8,21.14 19.29,21.14 IC5.3 | 18.73,20.83 C9.1 17.62,20.8 v17.62,20.03 | L2.1 17.52,13.69 v17.46,13.75 | 19.4,18.89 C11.1
  Top 0.203: C16.1 22.16,10.73 21.34,11.55 R6.2 19.75,11.08 v19.49,10.83 | C9.1 17.84,20.58 | C11.1 | BAT/3V3.3 27.78,17.14 27.56,16.92 23.62,16.92 22.61,17.94 19.65,17.94 19.4,18.19 | 19.4,18.89
  Top 0.305: LCD1.8
  Bottom 0.127: v10.68,3.5 10.68,4.73 12.34,6.39 v17.02,6.39 19.79,6.39 20.9,5.28 v20.9,4.52 22.47,4.52 | v50.6,9.6 50,9.6 49,8.6 v47.7,8.6 | v60.7,4 60.89,4 IC1.3
  Bottom 0.2: v17.46,13.75 17.03,13.32 17,13.32 | 17.63,18.89 17.62,18.9 v17.62,20.03
  Bottom 0.203: v19.49,10.83 17,13.32 15.13,15.19 v15.07,15.19
  Bottom 0.254: v15.07,15.19 15.07,16.34 17.63,18.89 v18.76,18.89
VCC_ANALOG  (via drill 0.2)
  Top 0.127: IC3.18 29.29,9.45 29.4,9.34 31.74,9.34 C17.1
  Top 0.2: L2.2 17.56,11.49 v17.56,10.45 | C17.1 32.18,10.01 32.13,10.06 v32.13,10.54
  Bottom 0.2: v17.56,10.45 18.26,10.45 19.07,9.64 27.7,9.64 29.24,11.18 31.5,11.18 v32.13,10.54

### Text on the board
tNames: GND | GND | PB1 | PB0 | PD7 | PD6 | PD5 | Pout | PD4 | PD3 | SCL | SDA | INT0 | Pout | SS2 | RST | CLK | DI | DO | Vcc | Gnd
bNames: SS2 | RST | CLK | DI | DO | Vcc | Gnd